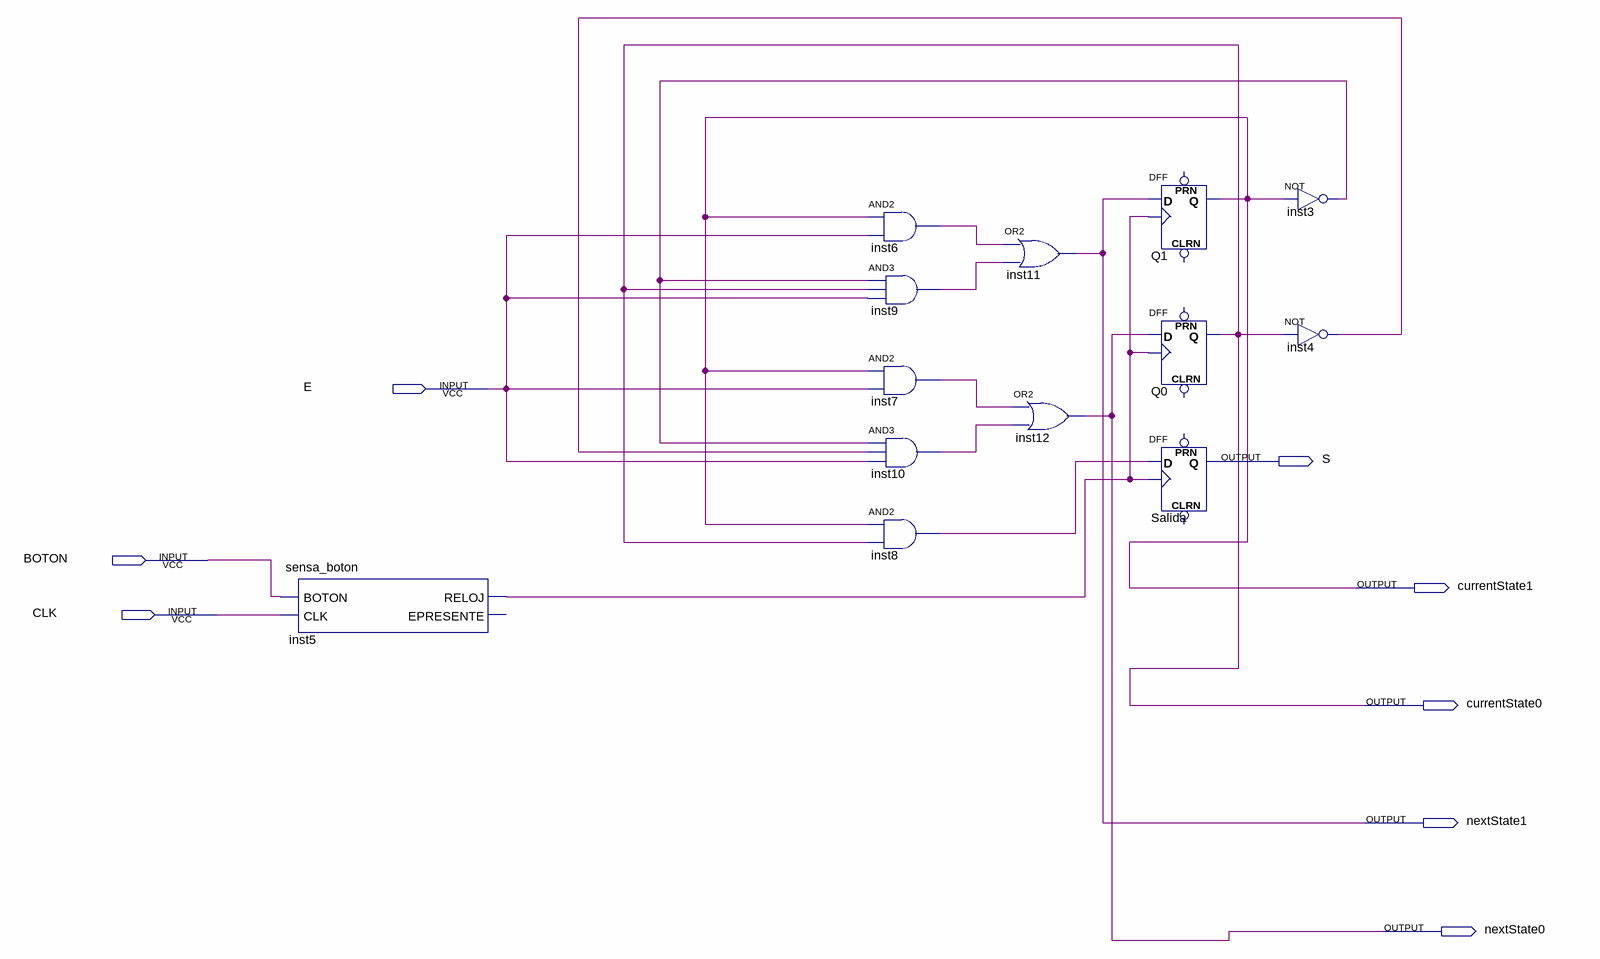
[diagram p0: schematic sheet]
// Quartus schematic practica2_ff.bdf as structural Verilog: 13 symbols, 8 pins
module practica2_ff (
  input  E,
  input  BOTON,
  input  CLK,
  output S,
  output currentState1,
  output currentState0,
  output nextState1,
  output nextState0
);

  wire inst3_out, inst4_out, inst5_reloj, inst6_out, inst7_out, inst8_out, inst9_out, inst10_out;

  sensa_boton inst5 (.BOTON(BOTON), .CLK(CLK), .RELOJ(inst5_reloj));  // open: EPRESENTE
  and inst6 (inst6_out, currentState1, E);
  and inst9 (inst9_out, inst3_out, currentState0, E);
  and inst7 (inst7_out, currentState1, E);
  and inst10 (inst10_out, inst3_out, inst4_out, E);
  and inst8 (inst8_out, currentState1, currentState0);
  or inst11 (nextState1, inst6_out, inst9_out);
  or inst12 (nextState0, inst7_out, inst10_out);
  DFF Q1 (.CLK(inst5_reloj), .D(nextState1), .Q(currentState1));  // open: CLRN, PRN
  DFF Q0 (.CLK(inst5_reloj), .D(nextState0), .Q(currentState0));  // open: CLRN, PRN
  DFF Salida (.CLK(inst5_reloj), .D(inst8_out), .Q(S));  // open: CLRN, PRN
  not inst3 (inst3_out, currentState1);
  not inst4 (inst4_out, currentState0);
endmodule
